# EAGLE design tx_train (EAGLE 6.5.0)
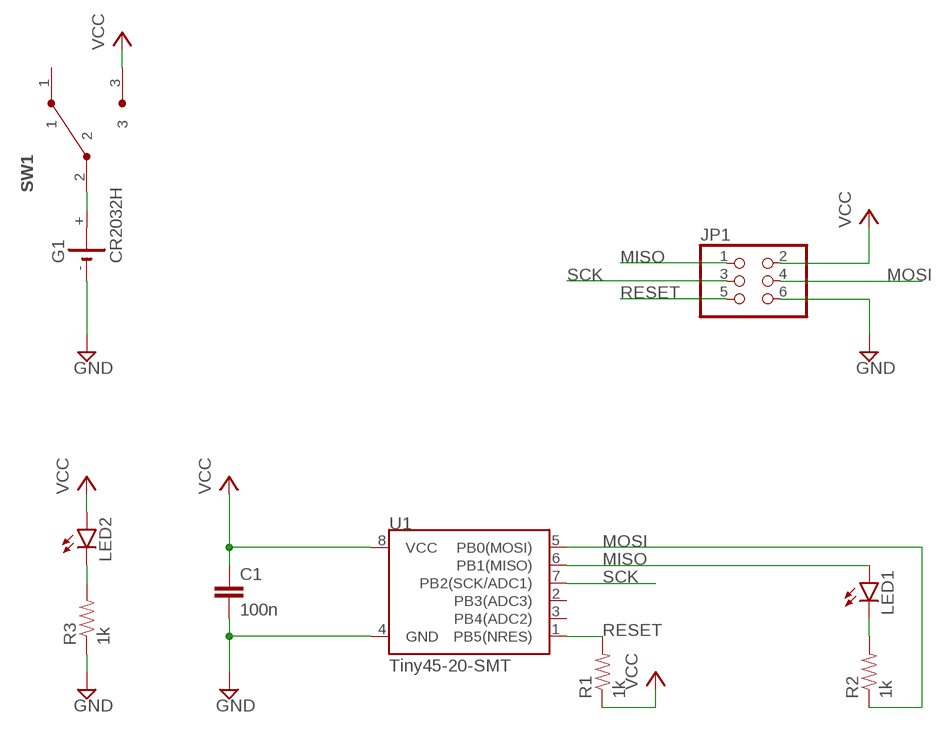
[diagram p0: schematic, sheet 1]

## Parts
C1  100n  CAP0603-CAP  [0603-CAP]
G1  CR2032H  [CR2032H]
JP1  PINHD-2X3  [2X03]
LED1  LED3MM  [LED3MM]
LED2  LED0603  [LED-0603]
R1  1k  RESISTOR0603  [0603-RES]
R2  1k  RESISTOR0603  [0603-RES]
R3  1k  RESISTOR0603  [0603-RES]
SW1  JS102011SAQN  [JS102011SAQN]
U1  Tiny45-20-SMT  ATTINY45TINY45-20-SMT  [SO08-EIAJ]

## Nets
GND: C1.2 G1.- JP1.6 R3.1 U1.4(GND)
MISO: JP1.1 LED1.A U1.6(PB1(MISO))
MOSI: JP1.4 R2.1 U1.5(PB0(MOSI))
N$3: LED1.K(C) R2.2
N$4: G1.+ SW1.2
N$5: LED2.C R3.2
RESET: JP1.5 R1.2 U1.1(PB5(NRES))
SCK: JP1.3 U1.7(PB2(SCK/ADC1))
VCC: C1.1 JP1.2 LED2.A R1.1 SW1.3 U1.8(VCC)
Unconnected: G1.+@1(+) SW1.1 U1.2(PB3(ADC3)) U1.3(PB4(ADC2))

## Library data of the parts
C1 = SparkFun-Capacitors:CAP: Capacitor Standard 0603 ceramic capacitor, and 0.1" leaded capacitor.
G1 = battery:CR2032H: LI BATTERY Varta
JP1 = pinhead:PINHD-2X3: PIN HEADER
LED1 LED2 = SparkFun-LED:LED: LEDs Standard schematic elements and footprints for 5mm, 3mm, 1206, and 0603 sized LEDs. 5mm - Spark Fun Electronics SKU : COM-00529 (and others)
R1-R3 = SparkFun-Resistors:RESISTOR: Resistor Basic schematic elements and footprints for 0603, 1206, and PTH resistors.
SW1 = tx_train:JS102011SAQN
U1 = SparkFun-DigitalIC:ATTINY45: Atmel 8-pin 2/4/8kB flash uC; PROD_ID: IC-08922

## Board
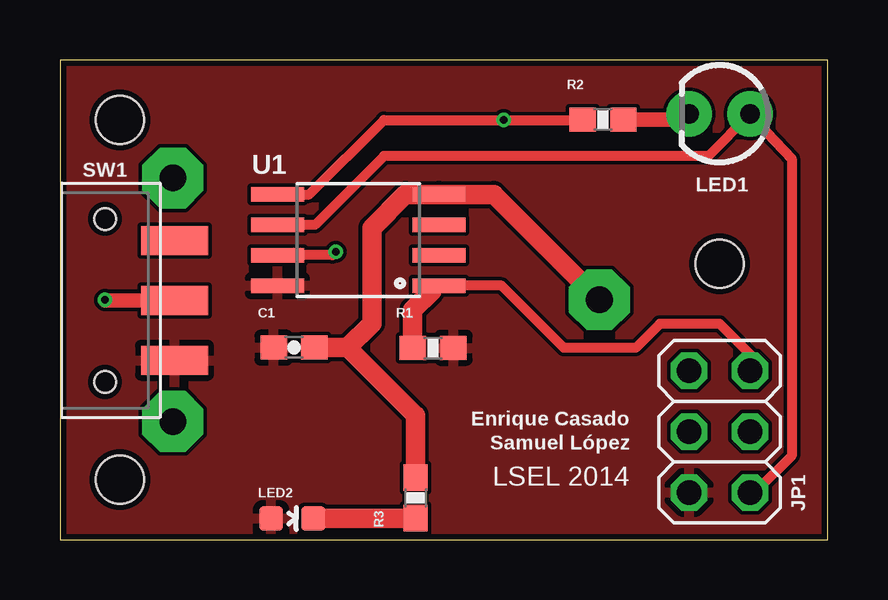
[diagram p1: board, top side]
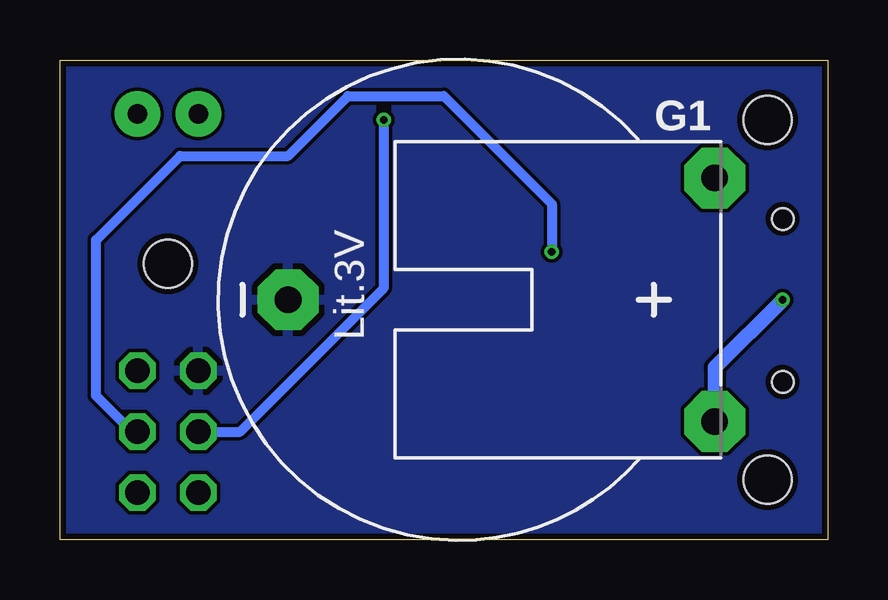
[diagram p2: board, bottom side, seen from below]

Size 32 x 20 mm. Coordinates in mm from the lower left corner, seen from the top.
Outline: 0,0 32,0 32,20 0,20 0,0
Copper layers (1*2*15*16): Top 0.035mm / dielectric 0.2mm / layer 2 0.0175mm / dielectric 1.1mm / layer 15 0.0175mm / dielectric 0.2mm / Bottom 0.035mm
Design rules "SeeedStudio_DRU_no_angle_20130527": minimum track width 6mil, minimum drill 12mil, track to track 6mil, track to pad 6mil, pad to pad 6mil, via to via 6mil, smd to smd 0mil, copper to edge 10mil, drill to drill 10mil, minimum pad ring 6mil, minimum via ring 6mil, stop-mask expansion 2mil, vias tented up to drill 25mil, thermal gap 10mil
Holes 2 mm at 2.5,17.5 2.5,2.5 27.5,11.5

### Footprints (pad centres in the part's own frame; a part is rotated, then mirrored left to right if it is on the bottom)
0603-CAP = smd 1.1 x 1: 1 -0.85,0; 2 0.85,0
CR2032H = drill 1.118 pad 2.54 octagon: + 5.08,10.795; +@1 -5.08,10.795; - 0,-6.985
2X03 = drill 1.016 octagon: 1 -2.54,-1.27; 2 -2.54,1.27; 3 0,-1.27; 4 0,1.27; 5 2.54,-1.27; 6 2.54,1.27
LED3MM = drill 0.813 pad 1.88: A -1.27,0; K 1.27,0
LED-0603 = smd 1 x 1: A 0,-0.877; C 0,0.877
0603-RES = smd 1.1 x 1: 1 -0.85,0; 2 0.85,0
JS102011SAQN = smd 1.2 x 2.8: 1 0.9,2.9; 2 3.4,2.9; 3 5.9,2.9 | hole 0.9: 0,0; 6.8,0
SO08-EIAJ = smd 0.61 x 2.21: 1 -1.905,-3.378; 2 -0.635,-3.378; 3 0.635,-3.378; 4 1.905,-3.378; 5 1.905,3.353; 6 0.635,3.353; 7 -0.635,3.353; 8 -1.905,3.353

### Placement (x,y rotation side)
C1  9.76,8.01 0 top
G1  15.5,10 270 bottom
JP1  27.5,4.5 90 top
LED1  27.5,17.75 180 top
LED2  9.68,0.88 270 top
R1  15.55,7.99 180 top
R2  22.64,17.51 0 top
R3  14.82,1.74 270 top
SW1  1.88,13.38 270 top
U1  12.42,12.49 90 top

### Tracks (layer width: path | path; a pad name or v marks a point on that pad's centre or on a via)
GND
  Top 0.813: C1.2 11.99,8.01 | 11.99,8.01 13,9.02 13,13 14.39,14.39 U1.4 18.09,14.39 G1.- | R3.1 14.82,5.18 11.99,8.01
  pour Bottom: 0,20 0,0 32,0 32,20
MISO
  Top 0.406: U1.6 10.62,13.12 13.5,16 27.04,16 LED1.A 30.5,15.89 30.5,3.5 28.96,1.96 JP1.1
MOSI  (via drill 0.3)
  Top 0.406: U1.5 10.39,14.39 13.5,17.5 v18.5,17.5 R2.1
  Bottom 0.406: JP1.4 24.5,4.5 18.5,10.5 v18.5,17.5
N$3
  Top 0.61: LED1.K 26.01,17.51 R2.2
N$4  (via drill 0.3)
  Top 0.406: 1.88,9.97 v1.88,10
  Top 0.61: SW1.2 1.88,9.97
  Bottom 0.61: v1.88,10 4.71,7.17 G1.+
N$5
  Top 0.813: R3.2 LED2.C
RESET
  Top 0.406: JP1.5 28.77,7.73 27.5,9 25,9 24,8 21,8 18.41,10.59 U1.1 15.59,10.38 15.5,10.38
  Top 0.813: R1.2 14.7,9.57 15.5,10.38
SCK  (via drill 0.3)
  Top 0.406: v11.5,12 11.36,11.86 U1.7
  Bottom 0.406: JP1.3 29,4.5 30.5,6 30.5,12.5 27,16 22.5,16 20,18.5 16,18.5 11.5,14 v11.5,12
VCC
  pour Top: 0,0 32,0 32,20 0,20

### Text on the board
tPlace: Enrique Casado | Samuel López | LSEL 2014